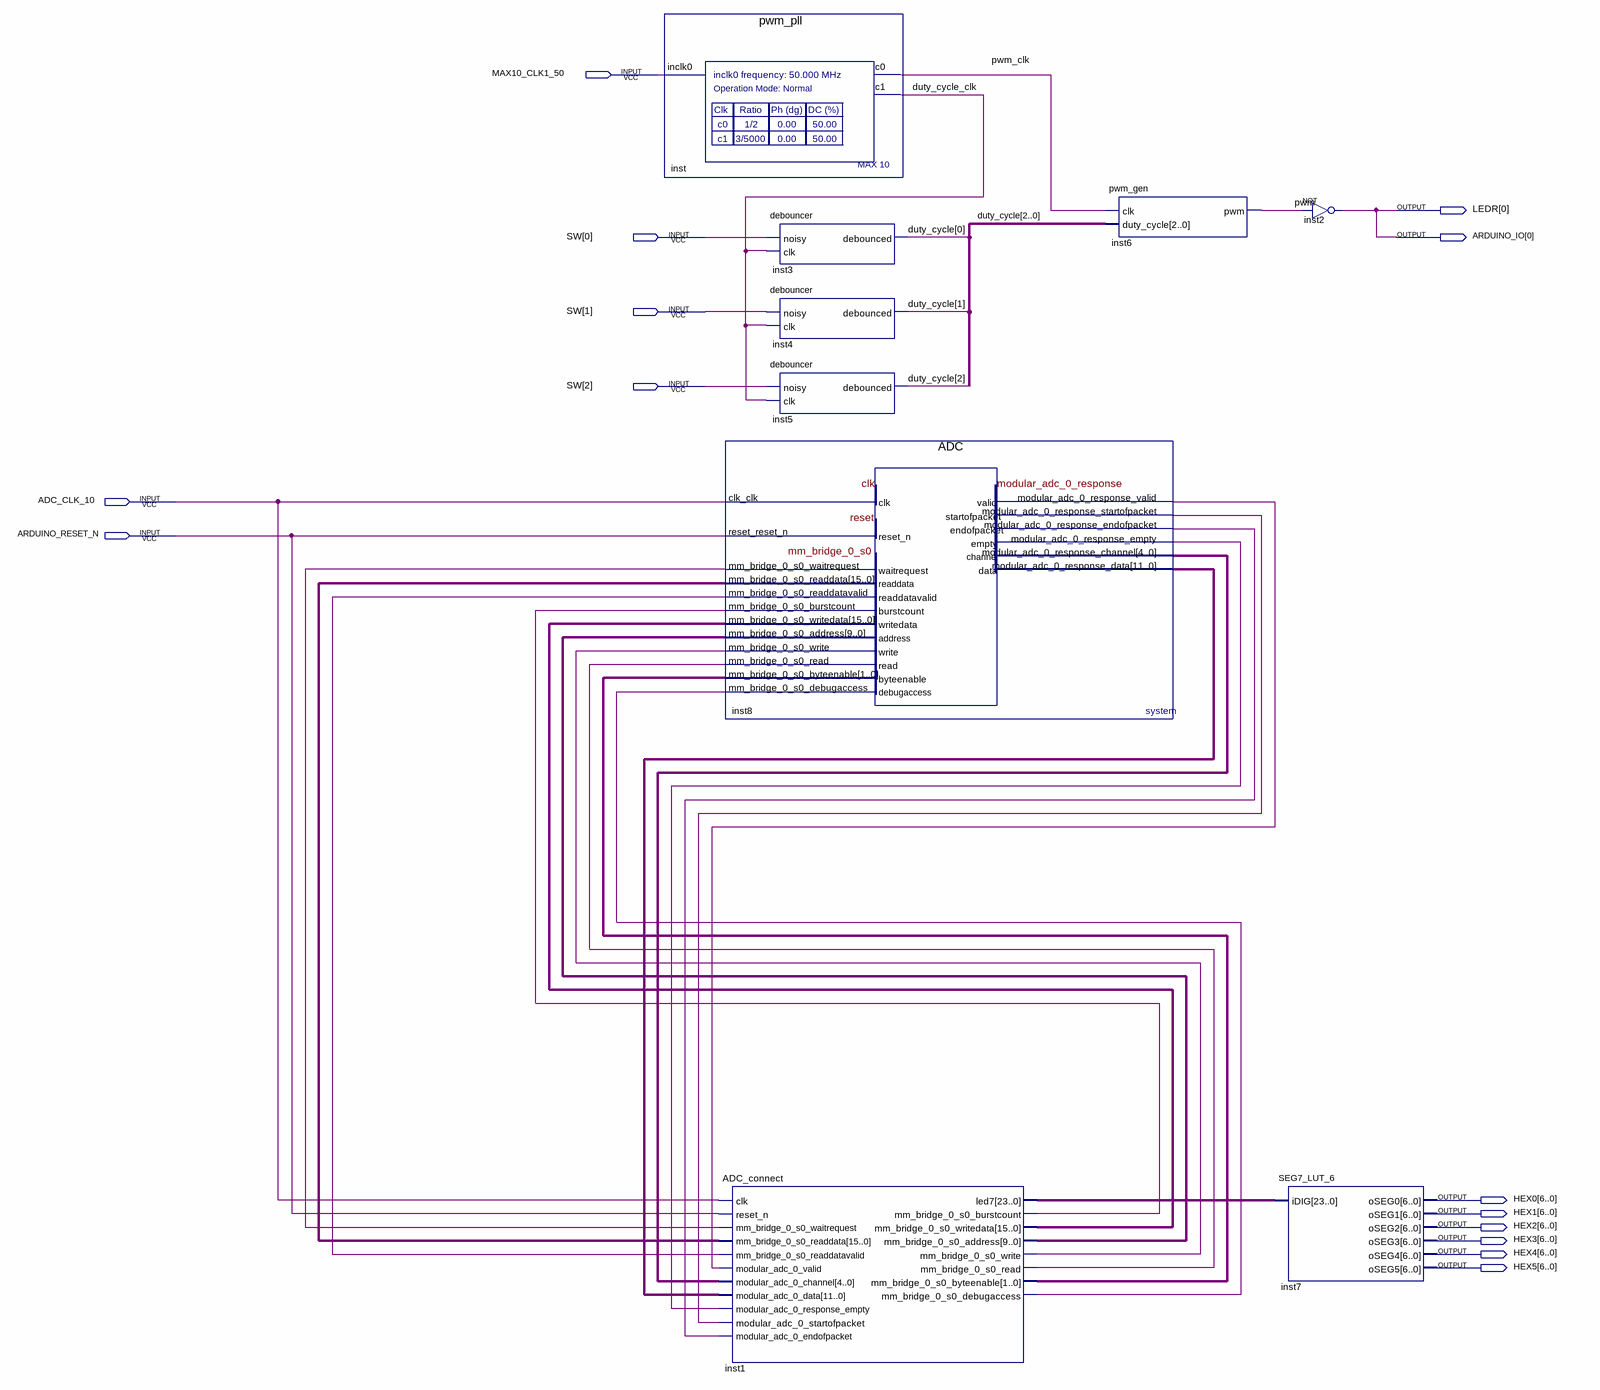
[diagram p0: schematic sheet]
// Quartus schematic pwm_led_top.bdf as structural Verilog: 9 symbols, 14 pins
module pwm_led_top (
  input  MAX10_CLK1_50,
  input  [2:0] SW,
  input  ADC_CLK_10,
  input  ARDUINO_RESET_N,
  output [0:0] LEDR,
  output [0:0] ARDUINO_IO,
  output [6:0] HEX0,
  output [6:0] HEX1,
  output [6:0] HEX2,
  output [6:0] HEX3,
  output [6:0] HEX4,
  output [6:0] HEX5
);

  wire duty_cycle_clk, inst1_mm_bridge_0_s0_burstcount, inst1_mm_bridge_0_s0_debugaccess,
       inst1_mm_bridge_0_s0_read, inst1_mm_bridge_0_s0_write, inst8_mm_bridge_0_s0_readdatavalid,
       inst8_mm_bridge_0_s0_waitrequest, inst8_modular_adc_0_response_empty,
       inst8_modular_adc_0_response_endofpacket, inst8_modular_adc_0_response_startofpacket,
       inst8_modular_adc_0_response_valid, pwm, pwm_clk;
  wire [1:0] inst1_mm_bridge_0_s0_byteenable;
  wire [2:0] duty_cycle;
  wire [4:0] inst8_modular_adc_0_response_channel;
  wire [9:0] inst1_mm_bridge_0_s0_address;
  wire [11:0] inst8_modular_adc_0_response_data;
  wire [15:0] inst1_mm_bridge_0_s0_writedata, inst8_mm_bridge_0_s0_readdata;
  wire [23:0] inst1_led7;

  pwm_pll inst (.inclk0(MAX10_CLK1_50), .c0(pwm_clk), .c1(duty_cycle_clk));
  debouncer inst3 (.noisy(SW[0]), .clk(duty_cycle_clk), .debounced(duty_cycle[0]));
  debouncer inst4 (.noisy(SW[1]), .clk(duty_cycle_clk), .debounced(duty_cycle[1]));
  debouncer inst5 (.noisy(SW[2]), .clk(duty_cycle_clk), .debounced(duty_cycle[2]));
  ADC inst8 (
    .clk_clk(ADC_CLK_10), .reset_reset_n(ARDUINO_RESET_N),
    .mm_bridge_0_s0_burstcount(inst1_mm_bridge_0_s0_burstcount),
    .mm_bridge_0_s0_writedata(inst1_mm_bridge_0_s0_writedata),
    .mm_bridge_0_s0_address(inst1_mm_bridge_0_s0_address), .mm_bridge_0_s0_write(inst1_mm_bridge_0_s0_write),
    .mm_bridge_0_s0_read(inst1_mm_bridge_0_s0_read),
    .mm_bridge_0_s0_byteenable(inst1_mm_bridge_0_s0_byteenable),
    .mm_bridge_0_s0_debugaccess(inst1_mm_bridge_0_s0_debugaccess),
    .modular_adc_0_response_valid(inst8_modular_adc_0_response_valid),
    .modular_adc_0_response_startofpacket(inst8_modular_adc_0_response_startofpacket),
    .modular_adc_0_response_endofpacket(inst8_modular_adc_0_response_endofpacket),
    .modular_adc_0_response_empty(inst8_modular_adc_0_response_empty),
    .modular_adc_0_response_channel(inst8_modular_adc_0_response_channel),
    .modular_adc_0_response_data(inst8_modular_adc_0_response_data),
    .mm_bridge_0_s0_waitrequest(inst8_mm_bridge_0_s0_waitrequest),
    .mm_bridge_0_s0_readdata(inst8_mm_bridge_0_s0_readdata),
    .mm_bridge_0_s0_readdatavalid(inst8_mm_bridge_0_s0_readdatavalid));
  ADC_connect inst1 (
    .clk(ADC_CLK_10), .reset_n(ARDUINO_RESET_N),
    .mm_bridge_0_s0_waitrequest(inst8_mm_bridge_0_s0_waitrequest),
    .mm_bridge_0_s0_readdata(inst8_mm_bridge_0_s0_readdata),
    .mm_bridge_0_s0_readdatavalid(inst8_mm_bridge_0_s0_readdatavalid),
    .modular_adc_0_valid(inst8_modular_adc_0_response_valid),
    .modular_adc_0_channel(inst8_modular_adc_0_response_channel),
    .modular_adc_0_data(inst8_modular_adc_0_response_data),
    .modular_adc_0_response_empty(inst8_modular_adc_0_response_empty),
    .modular_adc_0_startofpacket(inst8_modular_adc_0_response_startofpacket),
    .modular_adc_0_endofpacket(inst8_modular_adc_0_response_endofpacket), .led7(inst1_led7),
    .mm_bridge_0_s0_burstcount(inst1_mm_bridge_0_s0_burstcount),
    .mm_bridge_0_s0_writedata(inst1_mm_bridge_0_s0_writedata),
    .mm_bridge_0_s0_address(inst1_mm_bridge_0_s0_address), .mm_bridge_0_s0_write(inst1_mm_bridge_0_s0_write),
    .mm_bridge_0_s0_read(inst1_mm_bridge_0_s0_read),
    .mm_bridge_0_s0_byteenable(inst1_mm_bridge_0_s0_byteenable),
    .mm_bridge_0_s0_debugaccess(inst1_mm_bridge_0_s0_debugaccess));
  pwm_gen inst6 (.clk(pwm_clk), .duty_cycle(duty_cycle), .pwm(pwm));
  not inst2 (ARDUINO_IO[0], pwm);
  SEG7_LUT_6 inst7 (
    .iDIG(inst1_led7), .oSEG0(HEX0), .oSEG1(HEX1), .oSEG2(HEX2), .oSEG3(HEX3), .oSEG4(HEX4), .oSEG5(HEX5));

  assign LEDR[0] = ARDUINO_IO[0];
endmodule
